# EAGLE design light_module_v1 (EAGLE 6.4)

## Sheet 1 of 2
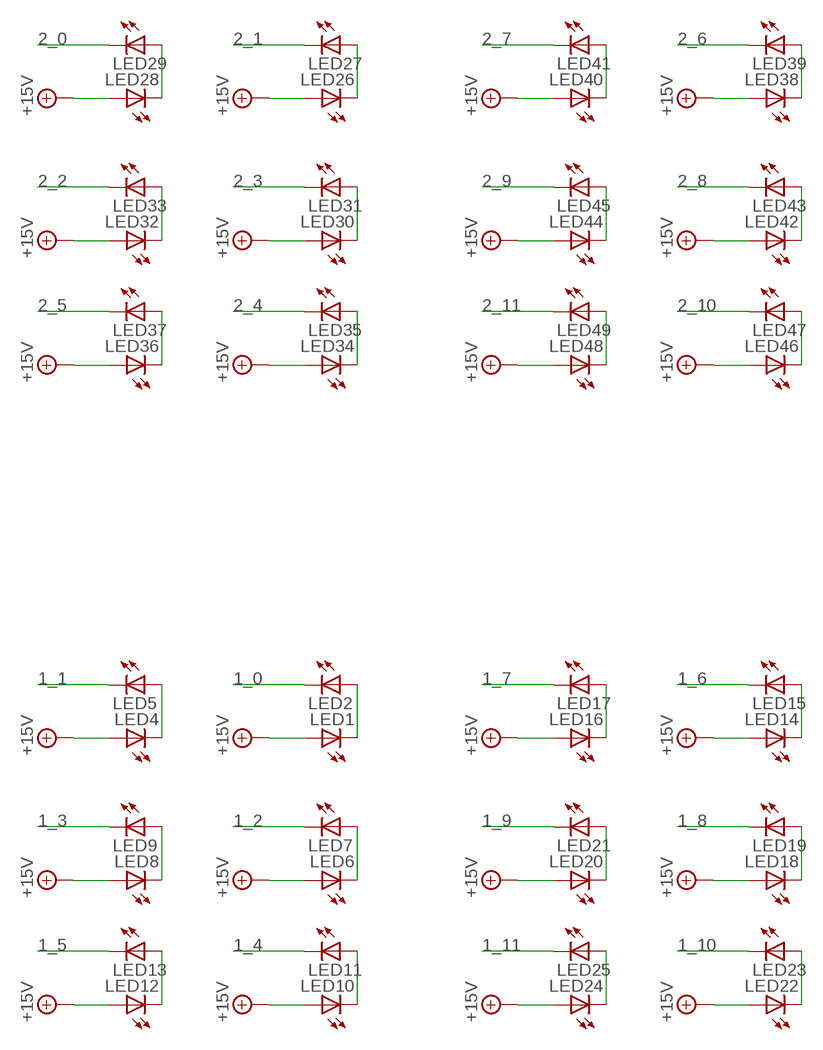
[diagram p0: schematic, sheet 1]

### Parts
LED1  LED  [DS205]
LED2  LED  [DS205]
LED4  LED  [DS205]
LED5  LED  [DS205]
LED6  LED  [DS205]
LED7  LED  [DS205]
LED8  LED  [DS205]
LED9  LED  [DS205]
LED10  LED  [DS205]
LED11  LED  [DS205]
LED12  LED  [DS205]
LED13  LED  [DS205]
LED14  LED  [DS205]
LED15  LED  [DS205]
LED16  LED  [DS205]
LED17  LED  [DS205]
LED18  LED  [DS205]
LED19  LED  [DS205]
LED20  LED  [DS205]
LED21  LED  [DS205]
LED22  LED  [DS205]
LED23  LED  [DS205]
LED24  LED  [DS205]
LED25  LED  [DS205]
LED26  LED  [DS205]
LED27  LED  [DS205]
LED28  LED  [DS205]
LED29  LED  [DS205]
LED30  LED  [DS205]
LED31  LED  [DS205]
LED32  LED  [DS205]
LED33  LED  [DS205]
LED34  LED  [DS205]
LED35  LED  [DS205]
LED36  LED  [DS205]
LED37  LED  [DS205]
LED38  LED  [DS205]
LED39  LED  [DS205]
LED40  LED  [DS205]
LED41  LED  [DS205]
LED42  LED  [DS205]
LED43  LED  [DS205]
LED44  LED  [DS205]
LED45  LED  [DS205]
LED46  LED  [DS205]
LED47  LED  [DS205]
LED48  LED  [DS205]
LED49  LED  [DS205]

### Nets
1_0: LED2.P$2(C) ; also sheet 2
1_1: LED5.P$2(C) ; also sheet 2
1_2: LED7.P$2(C) ; also sheet 2
1_3: LED9.P$2(C) ; also sheet 2
1_4: LED11.P$2(C) ; also sheet 2
1_5: LED13.P$2(C) ; also sheet 2
1_6: LED15.P$2(C) ; also sheet 2
1_7: LED17.P$2(C) ; also sheet 2
1_8: LED19.P$2(C) ; also sheet 2
1_9: LED21.P$2(C) ; also sheet 2
1_10: LED23.P$2(C) ; also sheet 2
1_11: LED25.P$2(C) ; also sheet 2
2_0: LED29.P$2(C) ; also sheet 2
2_1: LED27.P$2(C) ; also sheet 2
2_2: LED33.P$2(C) ; also sheet 2
2_3: LED31.P$2(C) ; also sheet 2
2_4: LED35.P$2(C) ; also sheet 2
2_5: LED37.P$2(C) ; also sheet 2
2_6: LED39.P$2(C) ; also sheet 2
2_7: LED41.P$2(C) ; also sheet 2
2_8: LED43.P$2(C) ; also sheet 2
2_9: LED45.P$2(C) ; also sheet 2
2_10: LED47.P$2(C) ; also sheet 2
2_11: LED49.P$2(C) ; also sheet 2
+15V: LED1.P$1(A) LED4.P$1(A) LED6.P$1(A) LED8.P$1(A) LED10.P$1(A) LED12.P$1(A) LED14.P$1(A) LED16.P$1(A) LED18.P$1(A) LED20.P$1(A) LED22.P$1(A) LED24.P$1(A) LED26.P$1(A) LED28.P$1(A) LED30.P$1(A) LED32.P$1(A) LED34.P$1(A) LED36.P$1(A) LED38.P$1(A) LED40.P$1(A) LED42.P$1(A) LED44.P$1(A) LED46.P$1(A) LED48.P$1(A) ; also sheet 2
N$5: LED1.P$2(C) LED2.P$1(A)
N$9: LED4.P$2(C) LED5.P$1(A)
N$10: LED6.P$2(C) LED7.P$1(A)
N$11: LED8.P$2(C) LED9.P$1(A)
N$12: LED10.P$2(C) LED11.P$1(A)
N$13: LED12.P$2(C) LED13.P$1(A)
N$14: LED14.P$2(C) LED15.P$1(A)
N$15: LED16.P$2(C) LED17.P$1(A)
N$16: LED18.P$2(C) LED19.P$1(A)
N$17: LED20.P$2(C) LED21.P$1(A)
N$18: LED22.P$2(C) LED23.P$1(A)
N$19: LED24.P$2(C) LED25.P$1(A)
N$20: LED26.P$2(C) LED27.P$1(A)
N$21: LED28.P$2(C) LED29.P$1(A)
N$22: LED30.P$2(C) LED31.P$1(A)
N$23: LED32.P$2(C) LED33.P$1(A)
N$24: LED34.P$2(C) LED35.P$1(A)
N$25: LED36.P$2(C) LED37.P$1(A)
N$26: LED38.P$2(C) LED39.P$1(A)
N$27: LED40.P$2(C) LED41.P$1(A)
N$28: LED42.P$2(C) LED43.P$1(A)
N$29: LED44.P$2(C) LED45.P$1(A)
N$30: LED46.P$2(C) LED47.P$1(A)
N$31: LED48.P$2(C) LED49.P$1(A)

## Sheet 2 of 2
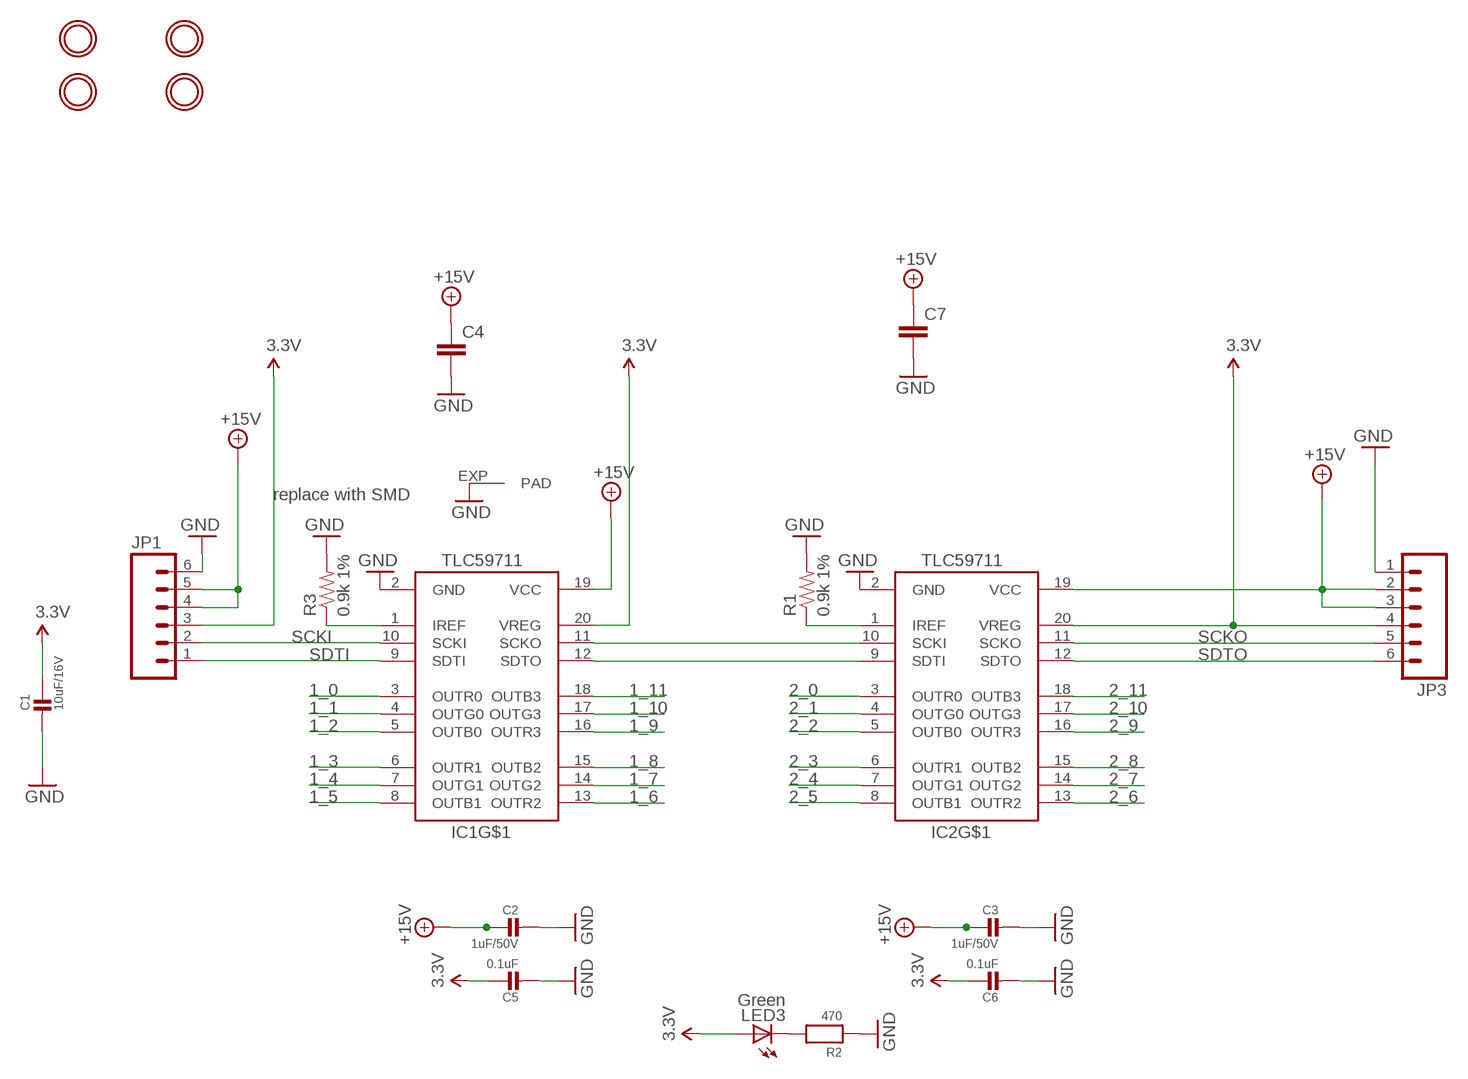
[diagram p1: schematic, sheet 2]

### Parts
C1  10uF/16V  CAP_CERAMIC0805  [0805]
C2  1uF/50V  CAP_CERAMIC0805  [0805]
C3  1uF/50V  CAP_CERAMIC0805  [0805]
C4  CAP1206  [1206]
C5  0.1uF  CAP_CERAMIC0805  [0805]
C6  0.1uF  CAP_CERAMIC0805  [0805]
C7  CAP_  [AXIAL-5MM]
IC1  TLC59711  [HTSSOP20DAP]
IC2  TLC59711  [HTSSOP20DAP]
JP1  M06SMD-STRAIGHT-COMBO-FEMALE  [1X06_SMD_STRAIGHT_COMBO]
JP3  M06SMD-STRAIGHT-COMBO-FEMALE  [1X06_SMD_STRAIGHT_COMBO]
LED3  Green  LEDCHIP-LED0805  [CHIP-LED0805]
R1  0.9k 1%  RESISTOR1206  [1206]
R2  470  RESISTOR0805  [0805]
R3  0.9k 1%  RESISTOR1206  [1206]
U$1  MOUNTINGHOLE2.5  [MOUNTINGHOLE_2.5_PLATED]
U$2  MOUNTINGHOLE2.5  [MOUNTINGHOLE_2.5_PLATED]
U$3  MOUNTINGHOLE2.5  [MOUNTINGHOLE_2.5_PLATED]
U$4  MOUNTINGHOLE2.5  [MOUNTINGHOLE_2.5_PLATED]

### Nets
1_0: IC1.3(OUTR0) ; also sheet 1
1_1: IC1.4(OUTG0) ; also sheet 1
1_2: IC1.5(OUTB0) ; also sheet 1
1_3: IC1.6(OUTR1) ; also sheet 1
1_4: IC1.7(OUTG1) ; also sheet 1
1_5: IC1.8(OUTB1) ; also sheet 1
1_6: IC1.13(OUTR2) ; also sheet 1
1_7: IC1.14(OUTG2) ; also sheet 1
1_8: IC1.15(OUTB2) ; also sheet 1
1_9: IC1.16(OUTR3) ; also sheet 1
1_10: IC1.17(OUTG3) ; also sheet 1
1_11: IC1.18(OUTB3) ; also sheet 1
2_0: IC2.3(OUTR0) ; also sheet 1
2_1: IC2.4(OUTG0) ; also sheet 1
2_2: IC2.5(OUTB0) ; also sheet 1
2_3: IC2.6(OUTR1) ; also sheet 1
2_4: IC2.7(OUTG1) ; also sheet 1
2_5: IC2.8(OUTB1) ; also sheet 1
2_6: IC2.13(OUTR2) ; also sheet 1
2_7: IC2.14(OUTG2) ; also sheet 1
2_8: IC2.15(OUTB2) ; also sheet 1
2_9: IC2.16(OUTR3) ; also sheet 1
2_10: IC2.17(OUTG3) ; also sheet 1
2_11: IC2.18(OUTB3) ; also sheet 1
3.3V: C1.1 C5.1 C6.1 IC1.20(VREG) IC2.20(VREG) JP1.3 JP3.4 LED3.A
+15V: C2.1 C3.1 C4.1 C7.P$1 IC1.19(VCC) IC2.19(VCC) JP1.4 JP1.5 JP3.2 JP3.3 ; also sheet 1
GND: C1.2 C2.2 C3.2 C4.2 C5.2 C6.2 C7.P$2 IC1.2(GND) IC1.EXP(PAD) IC2.2(GND) JP1.6 JP3.1 R1.2 R2.1 R3.2
N$1: LED3.C R2.2
N$2: IC1.1(IREF) R3.1
N$3: IC2.1(IREF) R1.1
N$4: IC1.11(SCKO) IC2.10(SCKI)
N$6: IC1.12(SDTO) IC2.9(SDTI)
SCKI: IC1.10(SCKI) JP1.2
SCKO: IC2.11(SCKO) JP3.5
SDTI: IC1.9(SDTI) JP1.1
SDTO: IC2.12(SDTO) JP3.6
Unconnected: IC2.EXP(PAD)

### Notes on the sheet
- replace with SMD

## Library data of the parts
C1-C3 C5 C6 = microbuilder:CAP_CERAMIC: Ceramic Capacitors For new designs, use the packages preceded by an '_' character since they are more reliable: The following footprints should be used on most boards: _0402 - Standard footprint for regular board layouts _0603 - Standard footprint for regular board layouts _0805 - Standard footprint for regular board layouts For extremely tight-pitch boards where space is at a premium, the following 'micro-pitch' footprints can be used (smaller pads, no silkscreen outline, etc.): _0402MP - Micro-pitch footprint for very dense/compact boards _0603MP - Micro-pitch footprint for very dense/compact boards _0805MP - Micro-pitch footprint for very dense/compact boards Commonly Stocked Parts 0402 - 0402 Surface Mount Capacitors 16pF 50V 5% [Digikey: 445-4899-2-ND] 18pF 50V 5% [Digikey: 490-1281-2-ND] 22pF 50V 5% [Digikey: 490-1283-2-ND] 68pF 50V 5% [Digikey: 490-1289-2-ND] 0.1uF 10V 10% [Digikey: 490-1318-2-ND] 1.0uF 6.3V 10% [Digikey: 490-1320-2-ND] 0603 - 0603 Surface Mount Capacitors 16 pF 50V 5% [Digikey: 445-5051-2-ND] 22 pF 50V [Digikey: PCC220ACVTR-ND] 33 pF 50V 5% [Digikey: 490-1415-1-ND] 56pF 50V 5% [Digikey: 490-1421-1-ND] 220pF 50V 5% [Digikey: 445-1285-1-ND] 680 pF 50V 2200 pF 50V 5% C0G [Digikey: 445-1297-1-ND] 5600 pF 100V 5% X7R [Digikey: 478-3711-1-ND] 0.1 µF 25V 10% [Digikey: PCC2277TR-ND] 0.22 µF 16V 10% X7R [Digikey: 445-1318-1-ND] 1.0 µF 25V 10% [Digikey: 445-5146-2-ND] 0603 - RF Specific 3pF 250V +/-0.1pF RF [Digikey: 712-1347-1-ND] 18 pF 250V 5% [Digikey: 478-3505-1-ND or 712-1322-1-ND] 56 pF 250V 5% C0G RF [Digikey: 490-4867-1-ND] 68 pF 250V RF [Digikey: 490-4868-1-ND] 0805 - 0805 Surface Mount Capacitors 220 pF 250V 2% RF Ceramic Capacitor [Digikey: 712-1398-1-ND] 1000 pF 50V 2% NP0 Ceramic Capacitor [Digikey: 478-3760-1-ND] 0.1 µF 25V 10% Ceramic Capacitor [Digikey: PCC1828TR-ND] 1.0 µF 16V 10% Ceramic Capacitor[Digikey: 490-1691-2-ND] 10.0 µF 10V 10% Ceramic Capacitor[Digikey: 709-1228-1-ND] 10.0 uF 16V 10% Ceramic Capacitor [Digikey: 478-5165-2-ND] 47 uF 6.3V 20% Ceramic Capacitor [Digikey: 587-1779-1-ND or 399-5506-1-ND] 1206 - 1206 Surface Mount Capacitors 47uF 10V 20% Ceramic Capacitor [Digikey: 490-5528-1-ND or 399-5508-1-ND or 445-6010-1-ND] 100uF 6.3V -20%, +80% Y5V Ceramic Capacitor (Digikey: 490-4512-1-ND, Mouser: 81-GRM31CF50J107ZE1L)
C4 C7 = SparkFun-Passives:CAP: Capacitor Standard 0603 ceramic capacitor, and 0.1" leaded capacitor.
IC1 IC2 = adafruit:TLC59711
JP1 JP3 = SparkFun-Connectors:M06: Header 6 Standard 6-pin 0.1" header. Use with straight break away headers (SKU : PRT-00116), right angle break away headers (PRT-00553), swiss pins (PRT-00743), machine pins (PRT-00117), and female headers (PRT-00115). Molex polarized connector foot print use with SKU : PRT-08094 with associated crimp pins and housings. NOTES ON THE VARIANTS LOCK and LOCK_LONGPADS... This footprint was designed to help hold the alignment of a through-hole component (i.e. 6-pin header) while soldering it into place. You may notice that each hole has been shifted either up or down by 0.005 of an inch from it's more standard position (which is a perfectly straight line). This slight alteration caused the pins (the squares in the middle) to touch the edges of the holes. Because they are alternating, it causes a "brace" to hold the component in place. 0.005 has proven to be the perfect amount of "off-center" position when using our standard breakaway headers. Although looks a little odd when you look at the bare footprint, once you have a header in there, the alteration is very hard to notice. Also,if you push a header all the way into place, it is covered up entirely on the bottom side. This idea of altering the position of holes to aid alignment will be further integrated into the Sparkfun Library for other footprints. It can help hold any component with 3 or more connection pins.; PROD_ID: CONN-10203
LED1 LED2 LED4-LED49 = digikey:LED
LED3 = adafruit:LED: LED OSRAM: - CHIPLED LG R971, LG N971, LY N971, LG Q971, LY Q971, LO R971, LY R971 LH N974, LH R974 LS Q976, LO Q976, LY Q976 LO Q996 - Hyper CHIPLED LW Q18S LB Q993, LB Q99A, LB R99A - SideLED LS A670, LO A670, LY A670, LG A670, LP A670 LB A673, LV A673, LT A673, LW A673 LH A674 LY A675 LS A676, LA A676, LO A676, LY A676, LW A676 LS A679, LY A679, LG A679 - Hyper Micro SIDELED® LS Y876, LA Y876, LO Y876, LY Y876 LT Y87S - SmartLED LW L88C, LW L88S LB L89C, LB L89S, LG L890 LS L89K, LO L89K, LY L89K LS L896, LA L896, LO L896, LY L896 - TOPLED LS T670, LO T670, LY T670, LG T670, LP T670 LSG T670, LSP T670, LSY T670, LOP T670, LYG T670 LG T671, LOG T671, LSG T671 LB T673, LV T673, LT T673, LW T673 LH T674 LS T676, LA T676, LO T676, LY T676, LB T676, LH T676, LSB T676, LW T676 LB T67C, LV T67C, LT T67C, LS T67K, LO T67K, LY T67K, LW E67C LS E67B, LA E67B, LO E67B, LY E67B, LB E67C, LV E67C, LT E67C LW T67C LS T679, LY T679, LG T679 LS T770, LO T770, LY T770, LG T770, LP T770 LB T773, LV T773, LT T773, LW T773 LH T774 LS E675, LA E675, LY E675, LS T675 LS T776, LA T776, LO T776, LY T776, LB T776 LHGB T686 LT T68C, LB T68C - Hyper Mini TOPLED® LB M676 - Mini TOPLED Santana® LG M470 LS M47K, LO M47K, LY M47K Source: http://www.osram.convergy.de/
R1 R3 = SparkFun-Passives:RESISTOR: Resistor Basic schematic elements and footprints for 0603, 1206, and PTH resistors.
R2 = microbuilder:RESISTOR: Resistors For new designs, use the packages preceded by an '_' character since they are more reliable: The following footprints should be used on most boards: _0402 - Standard footprint for regular board layouts _0603 - Standard footprint for regular board layouts _0805 - Standard footprint for regular board layouts For extremely tight-pitch boards where space is at a premium, the following 'micro-pitch' footprints can be used (smaller pads, no silkscreen outline, etc.): _0402MP - Micro-pitch footprint for very dense/compact boards _0603MP - Micro-pitch footprint for very dense/compact boards _0805MP - Micro-pitch footprint for very dense/compact boards
U$1-U$4 = microbuilder:MOUNTINGHOLE: Mounting Hole For #2 screws (0.086"/2.18mm width, 0.094"/2.4mm hole) use 2.5mm

## Board
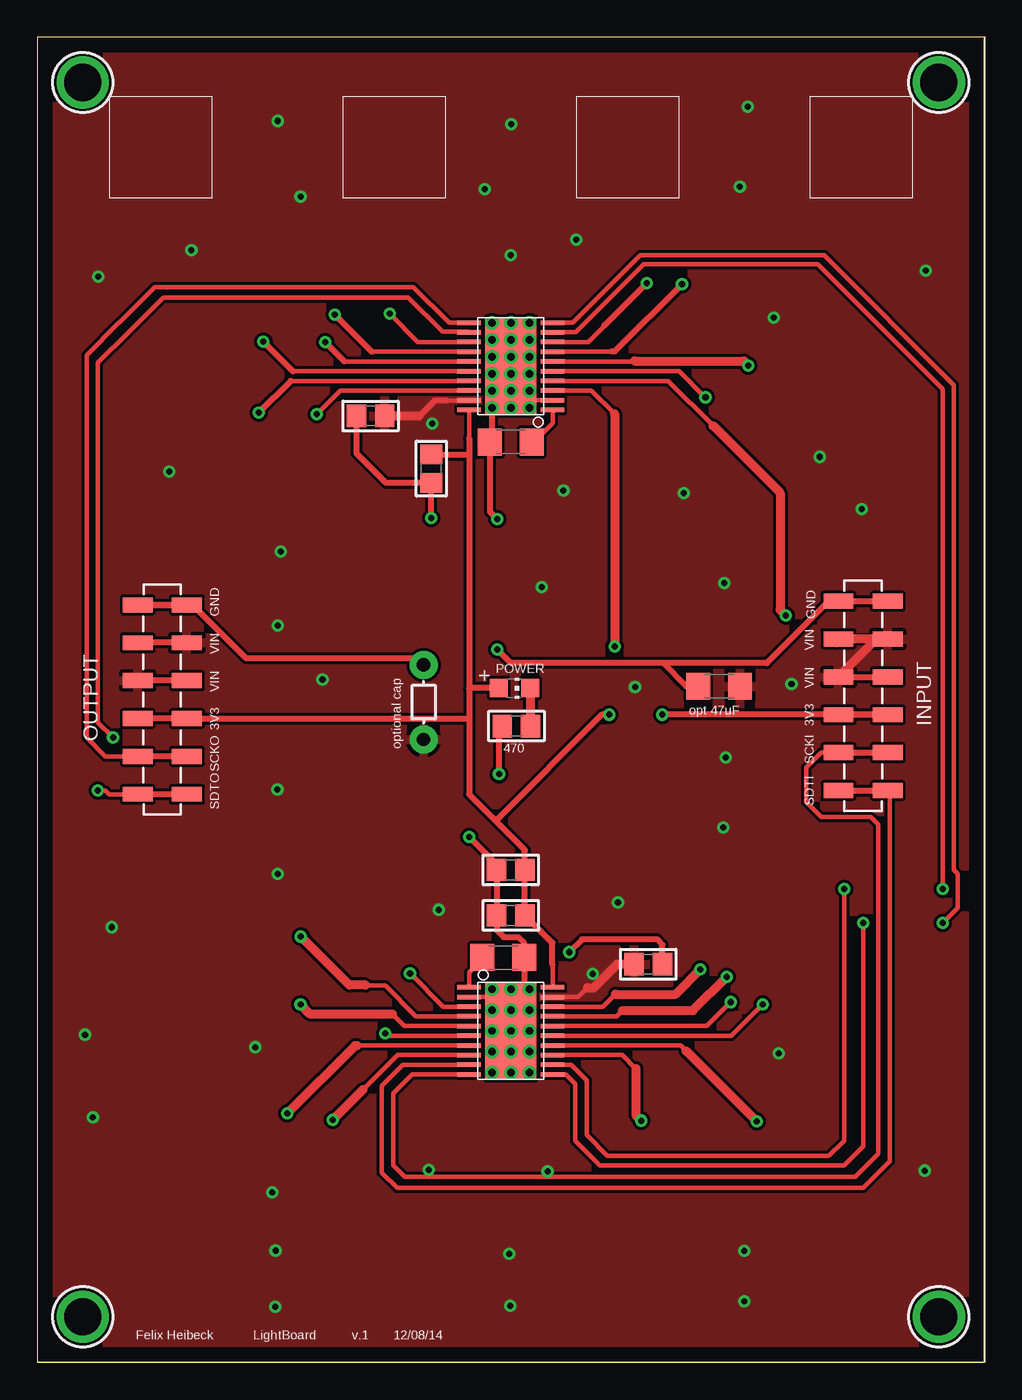
[diagram p2: board, top side]
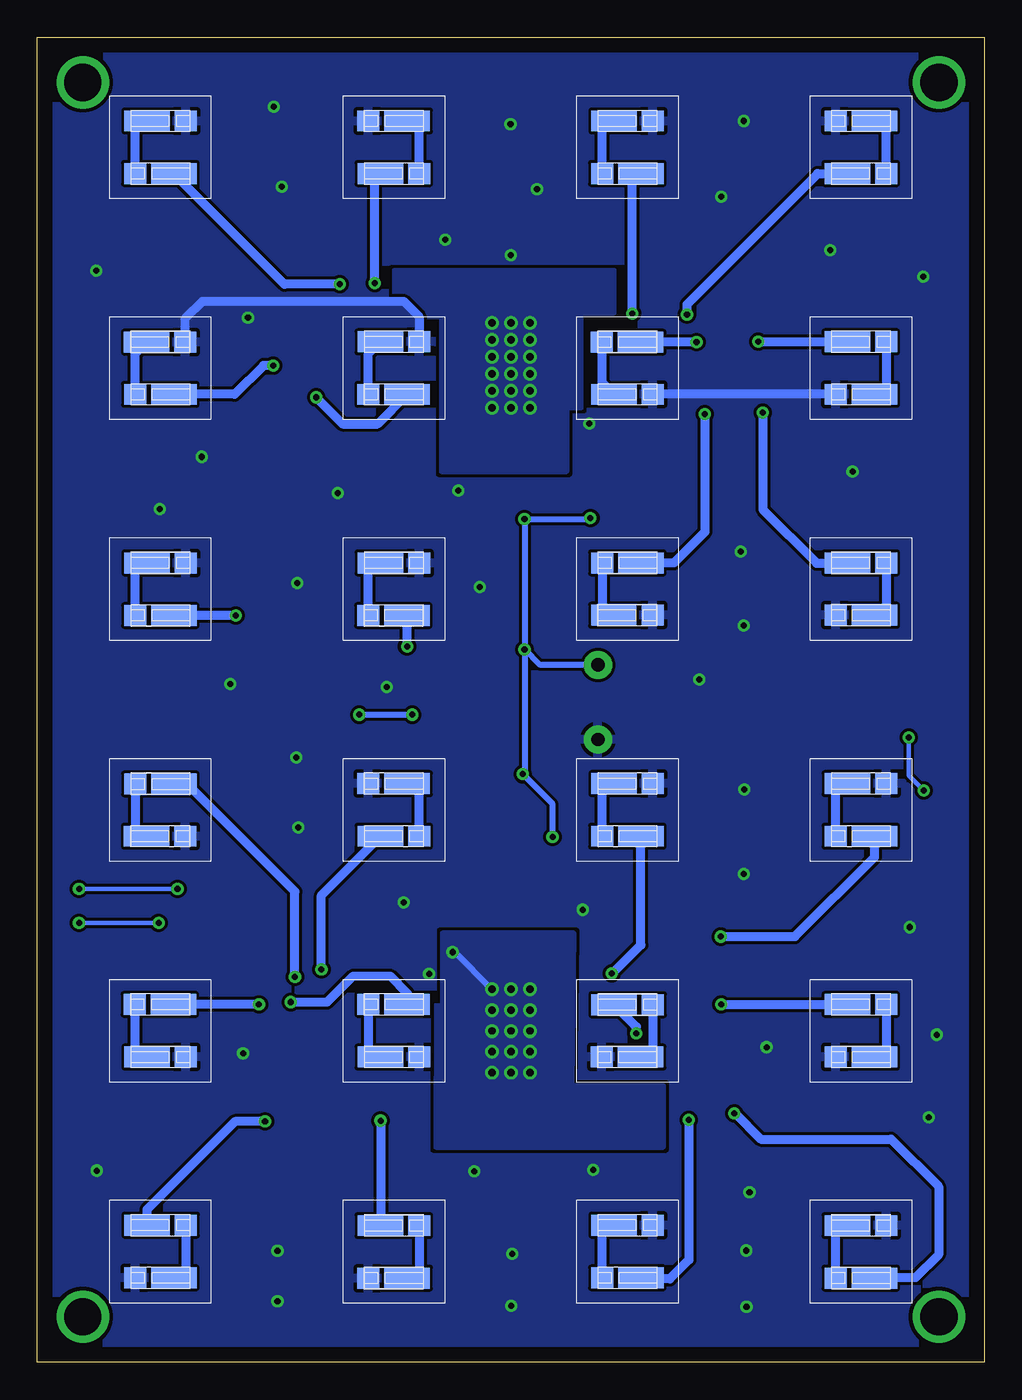
[diagram p3: board, bottom side, seen from below]

Size 63.51 x 88.87 mm. Coordinates in mm from the lower left corner, seen from the top.
Outline: 0,0 63.51,0 63.51,88.88 0,88.88 0,0
Copper layers (1*16): Top 0.035mm / dielectric 1.5mm / Bottom 0.035mm
Design rules "default *": minimum track width 10mil, minimum drill 24mil, track to track 8mil, track to pad 8mil, pad to pad 8mil, via to via 8mil, smd to smd 8mil, copper to edge 40mil, drill to drill 8mil, minimum pad ring 10mil, minimum via ring 8mil, stop-mask expansion 4mil, vias tented up to drill 16mil, thermal gap 10mil

### Footprints (pad centres in the part's own frame; a part is rotated, then mirrored left to right if it is on the bottom)
0805 = smd 1.3 x 1.5: 1 -0.95,0; 2 0.95,0
1206 = smd 1.6 x 1.8: 1 -1.4,0; 2 1.4,0
AXIAL-5MM = drill 0.9 pad 1.88: P$1 -2.5,0; P$2 2.5,0
HTSSOP20DAP = smd 0.3 x 1.55: 1 -2.925,-2.8; 2 -2.275,-2.8; 3 -1.625,-2.8; 4 -0.975,-2.8; 5 -0.325,-2.8; 6 0.325,-2.8; 7 0.975,-2.8; 8 1.625,-2.8; 9 2.275,-2.8; 10 2.925,-2.8; 11 2.925,2.8; 12 2.275,2.8; 13 1.625,2.8; 14 0.975,2.8; 15 0.325,2.8; 16 -0.325,2.8; 17 -0.975,2.8; 18 -1.625,2.8; 19 -2.275,2.8; 20 -2.925,2.8 | smd 6.5 x 3.4: EXP 0,0
1X06_SMD_STRAIGHT_COMBO = smd 1 x 2: 1 0,-1.65; 1-2 0,1.65; 2 2.54,1.65; 2-2 2.54,-1.65; 3 5.08,-1.65; 3-2 5.08,1.65; 4 7.62,1.65; 4-2 7.62,-1.65; 5 10.16,-1.65; 5-2 10.16,1.65; 6 12.7,1.65; 6-2 12.7,-1.65
DS205 = smd 1.473 x 1.4: P$1 -1.65,0 | smd 3.048 x 1.4: P$2 0.95,0
CHIP-LED0805 = smd 1.2 x 1.2: A 0,-1.05; C 0,1.05
MOUNTINGHOLE_2.5_PLATED = drill 2.5 pad 3.2: P$1 0,0

### Placement (x,y rotation side)
C1  31.75,29.97 180 top
C2  40.97,26.7 0 top
C3  22.35,63.47 180 top
C4  45.72,45.34 180 top
C5  31.75,33.02 180 top
C6  26.42,59.94 270 top
C7  25.91,44.27 90 top
IC1  31.75,22.23 270 top
IC2  31.75,66.8 90 top
JP1  55.37,38.35 90 top
JP3  8.38,50.8 270 top
LED1  23.88,38.81 180 bottom
LED2  23.98,35.28 0 bottom
LED3  32,45.21 270 top
LED4  8.23,38.81 180 bottom
LED5  8.33,35.28 0 bottom
LED6  8.33,20.47 0 bottom
LED7  8.23,24 180 bottom
LED8  24,20.47 0 bottom
LED9  23.88,23.98 180 bottom
LED10  8.23,9.17 180 bottom
LED11  8.33,5.64 0 bottom
LED12  23.88,9.19 180 bottom
LED13  23.98,5.66 0 bottom
LED14  39.65,5.64 0 bottom
LED15  39.55,9.17 180 bottom
LED16  55.3,5.66 0 bottom
LED17  55.19,9.19 180 bottom
LED18  55.19,20.47 180 bottom
LED19  55.32,24 0 bottom
LED20  39.55,20.47 180 bottom
LED21  39.65,24 0 bottom
LED22  55.22,35.28 180 bottom
LED23  55.3,38.79 0 bottom
LED24  39.65,38.81 0 bottom
LED25  39.55,35.28 180 bottom
LED26  55.19,53.62 180 bottom
LED27  55.3,50.09 0 bottom
LED28  39.55,53.62 180 bottom
LED29  39.67,50.09 0 bottom
LED30  55.22,68.43 180 bottom
LED31  55.3,64.92 0 bottom
LED32  39.55,68.45 180 bottom
LED33  39.65,64.92 0 bottom
LED34  55.19,83.26 180 bottom
LED35  55.3,79.73 0 bottom
LED36  39.65,83.26 0 bottom
LED37  39.55,79.73 180 bottom
LED38  23.88,83.26 180 bottom
LED39  23.98,79.73 0 bottom
LED40  8.33,83.26 0 bottom
LED41  8.23,79.73 180 bottom
LED42  23.88,64.92 180 bottom
LED43  24,68.43 0 bottom
LED44  8.33,64.92 0 bottom
LED45  8.23,68.45 180 bottom
LED46  8.33,50.11 0 bottom
LED47  8.23,53.62 180 bottom
LED48  23.9,50.11 180 bottom
LED49  23.98,53.62 0 bottom
R1  31.75,61.72 180 top
R2  32.13,42.67 0 top
R3  31.24,27.15 0 top
U$1  3.05,3.05 0 top
U$2  60.45,3.05 0 top
U$3  3.05,85.85 0 top
U$4  60.45,85.85 0 top

### Tracks (layer width: path | path; a pad name or v marks a point on that pad's centre or on a via)
1_0  (via drill 0.41)
  Top 0.305: IC1.3 27.23,23.85 v24.99,26.09
  Bottom 0.61: v24.99,26.09 24.94,26.09 23.04,27.99 LED2.P$2
1_1  (via drill 0.41)
  Top 0.305: IC1.4 25.39,23.2 23.32,25.27 22.05,25.27 22.02,25.3
  Top 0.61: 22.02,25.3 20.93,25.3 v17.68,28.55
  Bottom 0.61: v17.68,28.55 12.7,28.55 7.37,33.88 7.37,35.27 LED5.P$2
1_2  (via drill 0.41)
  Top 0.305: IC1.5 24.62,22.55 23.82,23.34
  Top 0.61: 23.82,23.34 18.31,23.34 v17.65,24
  Bottom 0.61: v17.65,24 LED7.P$2
1_3  (via drill 0.41)
  Top 0.305: IC1.6 23.49,21.9 v23.34,22.05
  Bottom 0.61: v23.34,22.05 23.34,22.49 LED9.P$2
1_4  (via drill 0.41)
  Top 0.305: IC1.7 21.45,21.25 21.44,21.23
  Top 0.61: 21.44,21.23 21.31,21.23 v16.76,16.69
  Bottom 0.61: v16.76,16.69 16.71,16.69 14.99,14.96 6.25,14.96 3.07,11.79 3.07,7.21 4.62,5.66 7.36,5.66 LED11.P$2
1_5  (via drill 0.41)
  Top 0.305: IC1.8 24.16,20.6 21.84,18.29
  Top 0.61: 21.84,18.29 v19.81,16.26
  Bottom 0.61: v19.81,16.26 19.81,6.86 21.08,5.59 22.95,5.59 LED13.P$2
1_6  (via drill 0.41)
  Top 0.305: IC1.13 39.22,20.6 40.13,19.68
  Top 0.61: 40.13,19.68 40.13,16.56 v40.49,16.2
  Bottom 0.406: 40.49,9.18 LED15.P$2
  Bottom 0.61: v40.49,16.2 40.49,9.18
1_7  (via drill 0.41)
  Top 0.305: IC1.14 43.14,21.25 43.51,20.88
  Top 0.61: 43.51,20.88 v48.23,16.15
  Bottom 0.406: 56.16,9.21 LED17.P$2
  Bottom 0.61: v48.23,16.15 50.24,16.15 56.16,10.24 56.16,9.21
1_8  (via drill 0.41)
  Top 0.305: IC1.15 46.54,21.9 v48.64,24
  Bottom 0.61: v48.64,24 LED19.P$2
1_9  (via drill 0.41)
  Top 0.305: IC1.16 44.9,22.55 v46.51,24.16
  Bottom 0.61: v46.51,24.16 44.07,24.16 42.32,25.91 39.85,25.91 38.68,24.74 38.68,24.02 LED21.P$2
1_10  (via drill 0.41)
  Top 0.305: IC1.17 38.85,23.2 39.24,23.6
  Top 0.61: 39.24,23.6 43.97,23.6 v46.23,25.86
  Bottom 0.61: v46.23,25.86 46.23,31.57 53.44,38.79 LED23.P$2
1_11  (via drill 0.41)
  Top 0.305: IC1.18 37.92,23.85 38.76,24.69
  Top 0.61: 38.76,24.69 42.8,24.69 v44.45,26.34
  Bottom 0.61: v44.45,26.34 44.45,31.33 LED25.P$2
2_0  (via drill 0.41)
  Top 0.305: IC2.3 37.16,65.18 38.71,63.63
  Top 0.61: 38.71,63.63 v38.71,48.01
  Bottom 0.61: v38.71,48.01 38.71,50.07 LED29.P$2
2_1  (via drill 0.41)
  Top 0.305: IC2.4 42.3,65.83 45.31,62.81
  Top 0.61: 45.31,62.81 49.81,58.32 49.81,50.47 v50.19,50.09
  Bottom 0.61: v50.19,50.09 LED27.P$2
2_2  (via drill 0.41)
  Top 0.305: IC2.5 43.05,66.48 v44.81,64.72
  Bottom 0.61: v44.81,64.72 43.03,62.94 40.68,62.94 LED33.P$2
2_3  (via drill 0.41)
  Top 0.305: IC2.6 40,67.13 40.03,67.16
  Top 0.61: 40.03,67.16 47.37,67.16 v47.68,66.85
  Bottom 0.61: v47.68,66.85 48.34,66.85 50.27,64.92 LED31.P$2
2_4  (via drill 0.41)
  Top 0.305: IC2.7 38.47,67.78 38.51,67.82
  Top 0.406: 38.51,67.82 38.73,67.82 v43.23,72.31
  Bottom 0.61: v43.23,72.31 46.93,72.31 LED35.P$2
2_5  (via drill 0.41)
  Top 0.305: IC2.8 36.93,68.43 38.05,69.55
  Top 0.406: 38.05,69.55 38.05,69.57 v40.87,72.39
  Bottom 0.61: v40.87,72.39 40.87,79.36 LED37.P$2
2_6  (via drill 0.41)
  Top 0.305: IC2.13 25.53,68.43 v23.62,70.33
  Bottom 0.61: v23.62,70.33 23.62,79.14 LED39.P$2
2_7  (via drill 0.41)
  Top 0.305: IC2.14 22.44,67.78
  Top 0.406: 22.44,67.78 v19.94,70.28
  Bottom 0.61: v19.94,70.28 19.94,70.97 11.18,79.73 LED41.P$2
2_8  (via drill 0.41)
  Top 0.305: IC2.15 20.61,67.13
  Top 0.406: 20.61,67.13 v19.3,68.43
  Bottom 0.61: v19.3,68.43 LED43.P$2
2_9  (via drill 0.41)
  Top 0.305: IC2.16 17.14,66.48
  Top 0.406: 17.14,66.48 v15.16,68.45
  Bottom 0.61: v15.16,68.45 LED45.P$2
2_10  (via drill 0.41)
  Top 0.305: IC2.17 16.98,65.83
  Top 0.406: 16.98,65.83 v14.86,63.7
  Bottom 0.61: v14.86,63.7 14.86,57.2 11.25,53.59 9.21,53.59 LED47.P$2
2_11  (via drill 0.41)
  Top 0.305: IC2.18 20.32,65.18 v18.75,63.6
  Bottom 0.61: v18.75,63.6 18.75,55.7 20.83,53.62 LED49.P$2
3.3V  (via drill 0.41)
  Top 0.305: 28.95,61.98 28.96,61.98 IC2.20 | IC1.20 34.55,26.66 34.54,26.67
  Top 0.406: 34.54,26.67 34.54,28.13 C1.1 C5.1 32.7,34.36 30.73,36.32 | 30.73,36.32 28.96,38.1 28.96,43.18 | 28.96,61.98 28.96,60.96 | 28.96,60.96 28.96,45.21 | 28.96,45.21 28.96,43.18 | C6.1 28.89,60.89 28.96,60.96 | LED3.A 28.96,45.21 | JP3.4 28.96,43.18 | JP1.3 v41.91,43.43 | v38.35,43.43 37.85,43.43 30.73,36.32
  Bottom 0.406: v41.91,43.43 v38.35,43.43
+15V  (via drill 0.41)
  Top 0.305: 27.43,64.52 28.94,64.52 IC2.19 | IC1.19 36.26,24.5 36.88,25.12
  Top 0.406: 27.43,64.52 26.64,64.52 25.6,63.48
  Top 0.61: JP1.4 56.26,48.51 JP1.5 53.85,48.51 53.59,48.26 | 25.6,63.48 C3.1 | C2.1 38.89,26.7 37.31,25.12 36.88,25.12
  Bottom 0.61: LED44.P$1 LED42.P$1 | LED30.P$1 53.57,70.03 52.43,71.17 38.94,71.17 37.9,70.13 LED32.P$1
  other vias: 47.4,7.47 37.24,26.06 34.21,12.8 31.65,7.26 15.98,7.49 14.61,21.13 49.71,20.73 16.1,38.43 46,35.86 16.33,54.38 16.13,49.43 55.3,57.23 46.08,52.27 33.83,51.99 17.65,78.18 16.13,83.26 31.78,83.03 30,78.69 47.65,84.23 47.12,78.84 49.38,70.08 4.09,72.82 59.56,73.23 31.75,74.27 3.2,21.97 15.75,11.4 26.24,12.9 59.51,12.85 47.4,4.09 31.72,3.78 15.95,3.71 16.13,32.77 26.92,30.35 38.94,30.84 46.15,40.56 50.57,45.49 43.36,58.29 35.28,58.47 8.84,59.74 19.13,45.8 36.14,75.31 10.34,74.6 5,29.18 3.73,16.43 40.08,45.29 26.49,62.97 52.48,60.73
  pour Top: -2.03,90.93 64.26,90.68 64.26,-3.3 -3.81,-3.05 -3.81,90.93
  pour Bottom (rank 2): -1.27,90.42 65.02,90.17 65.02,-3.81 -3.05,-3.56 -3.05,90.42
GND  (via drill 0.41, 0.5)
  Top 0.305: IC2.2 32.27,64.53 v31.75,64.01 | IC1.2 31.23,24.5 v31.75,25.02
  Top 0.406: v30.48,64.01 30.48,62.09 R1.2 30.35,57.05 v30.84,56.57 v30.85,56.58 | C3.2 21.4,60.97 23.37,59 26.41,59 C6.2 v26.42,56.62 | 32.65,24.52 R3.2 32.64,27.19 32.64,28.12 32.23,28.52 31.27,28.52 30.8,28.99 C1.2 C5.2 30.8,33.39 v28.96,35.23 | 32.65,24.52 v31.75,23.62 | C2.2 41.92,28.01 41.55,28.37 36.52,28.37 v35.66,27.51 | v30.96,39.45 30.96,42.45 R2.1 | JP1.6 53.09,51.05 48.92,46.89 41.96,46.89 | 41.96,46.89 31.75,46.89 v30.84,47.8 | C4.2 43.51,45.34 41.96,46.89 | 32.65,24.52 32.65,23.99 v33.02,23.62 | v33.02,20.83 v33.02,22.23 IC1.EXP v30.48,22.23 | v33.02,20.83 v31.75,20.83 v30.48,20.83 | v33.02,20.83 33.02,20.7 v31.75,19.43 | v33.02,19.43 v33.02,20.83 | JP3.1 10.41,50.8 13.97,47.24 25.44,47.24 C7.P$2
  Bottom 0.406: v26.42,56.62 26.47,56.57 v30.84,56.57 v30.84,47.8 | v35.66,27.51 35.51,27.51 v33.02,25.02 | v28.96,35.23 28.96,37.44 v30.96,39.45 30.84,39.57 v30.84,47.8 | C7.P$2 29.8,46.77 v30.84,47.8 | v30.48,25.02 30.48,24.89 | 31.62,24.89 v31.75,25.02
  other vias: 30.48,23.62 31.75,22.23 33.02,64.01 31.75,65.15 31.75,66.29 31.75,67.44 31.75,68.58 31.75,69.72 33.02,65.15 33.02,66.29 33.02,67.44 30.48,65.15 30.48,66.29 30.48,67.44 33.02,68.58 33.02,69.72 30.48,68.58 30.48,69.72 30.48,19.43
  pour Bottom: 27.53,28.75 36.32,28.75 36.32,23.88 36.68,23.88 36.68,23.93 36.73,23.93 36.75,14.45 21.54,14.45 21.54,18.52 27.66,18.52 27.66,18.57
  pour Bottom: 24.84,73.2 39.55,73.2 39.55,70.18 36.4,70.18 36.4,59.79 28.02,59.79 28.02,64.06 27.05,64.06 27.05,70.41 24.84,70.41
N$1
  Top 0.61: LED3.C 33.05,42.7 R2.2
N$2
  Top 0.305: R3.1 29.97,27.18 28.96,26.16 IC1.1
N$3
  Top 0.305: IC2.1 34.55,63 33.27,61.72 R1.1
N$4  (via drill 0.41)
  Top 0.305: v60.71,29.46 61.72,30.48 61.72,32.77 61.47,33.02 61.47,65.53 52.76,74.24 40.44,74.24 35.92,69.72 IC2.10 | v55.37,29.46 55.37,14.48 54.1,13.21 37.72,13.21 36.07,14.86 36.07,18.67 35.43,19.3 IC1.11
  Bottom 0.305: v60.71,29.46 v55.37,29.46
N$5
  Bottom 0.61: LED2.P$1 25.63,38.74 25.55,38.81 LED1.P$2
N$6  (via drill 0.41)
  Top 0.305: v54.1,31.75 54.1,14.86 53.09,13.84 38.23,13.84 36.83,15.24 36.83,18.92 35.8,19.95 IC1.12 | v60.71,31.75 60.71,65.28 57.05,68.94 56.9,69.09 52.32,73.66 40.66,73.66 36.09,69.09 IC2.9
  Bottom 0.305: v54.1,31.75 v60.71,31.75
N$9
  Bottom 0.61: LED5.P$1 9.98,38.56 9.73,38.81 LED4.P$2
N$10
  Bottom 0.61: LED7.P$1 6.58,20.65 6.78,20.45 7.36,20.45 LED6.P$2
N$11
  Bottom 0.61: LED9.P$1 22.23,20.47 22.28,20.42 23,20.42 LED8.P$2
N$12
  Bottom 0.61: LED11.P$1 9.98,9.02 9.88,9.12 9.23,9.12 LED10.P$2
N$13
  Bottom 0.61: LED13.P$1 25.63,9.04 25.48,9.2 LED12.P$2
N$14
  Bottom 0.61: LED15.P$1 37.9,5.84 38.1,5.64 LED14.P$2
N$15
  Bottom 0.61: LED17.P$1 53.54,5.84 53.7,5.69 54.32,5.69 LED16.P$2
N$16
  Bottom 0.61: LED19.P$1 56.97,20.47 LED18.P$2
N$17
  Bottom 0.61: LED21.P$1 41.3,20.52 41.4,20.42 40.55,20.42 LED20.P$2
N$18
  Bottom 0.61: LED23.P$1 56.95,35.36 57,35.31 56.2,35.31 LED22.P$2
N$19
  Bottom 0.61: LED25.P$1 37.9,38.71 38.02,38.84 38.67,38.84 LED24.P$2
N$20
  Bottom 0.61: LED27.P$1 56.95,53.54 56.84,53.65 56.17,53.65 LED26.P$2
N$21
  Bottom 0.61: LED29.P$1 41.33,53.52 41.25,53.59 40.52,53.59 LED28.P$2
N$22
  Bottom 0.61: LED31.P$1 56.95,67.65 LED30.P$2
N$23
  Bottom 0.61: LED33.P$1 41.3,67.65 LED32.P$2
N$24
  Bottom 0.61: LED35.P$1 56.95,83.18 57,83.24 56.17,83.24 LED34.P$2
N$25
  Bottom 0.61: LED37.P$1 37.9,83.11 38.05,83.26 LED36.P$2
N$26
  Bottom 0.61: LED39.P$1 25.63,83.26 25.65,83.29 24.85,83.29 LED38.P$2
N$27
  Bottom 0.61: LED41.P$1 6.58,83.21 6.63,83.26 LED40.P$2
N$28
  Bottom 0.61: LED43.P$1 25.65,65.75 LED42.P$2
N$29
  Bottom 0.61: LED45.P$1 6.58,65.02 6.76,64.85 7.3,64.85 LED44.P$2
N$30
  Bottom 0.61: LED47.P$1 6.58,50.19 6.68,50.09 7.36,50.09 LED46.P$2
N$31
  Bottom 0.61: LED49.P$1 25.63,50.22 25.73,50.11 LED48.P$2
SCKI
  Top 0.305: IC1.10 25.15,19.3 23.88,18.03 23.88,13.21 24.64,12.45 54.86,12.45 56.39,13.97 56.39,36.07 55.88,36.58 52.58,36.58 51.56,37.59 51.56,39.88 52.58,40.89 JP1.2
SCKO
  Top 0.305: JP3.5 4.57,40.64 3.3,41.91 3.3,67.56 5.46,69.73 5.49,69.73 7.87,72.11 25.22,72.11 27.61,69.72 IC2.11
SDTI
  Top 0.305: IC1.9 24.52,19.95 23.11,18.54 23.11,12.7 24.13,11.68 55.37,11.68 57.15,13.46 57.15,38.23 JP1.1
SDTO  (via drill 0.41)
  Top 0.305: v5.08,41.91 4.06,42.93 4.06,67.06 6.08,69.08 6.11,69.08 8.46,71.42 24.87,71.42 27.18,69.11 28.91,69.11 IC2.12 | v4.06,38.35 4.57,38.35 4.83,38.1 JP3.6
  Bottom 0.305: v5.08,41.91 5.08,39.37 v4.06,38.35

### Text on the board
tPlace: POWER | opt 47uF | INPUT | OUTPUT | optional cap | 470 | Felix Heibeck | LightBoard | v.1 | 12/08/14
tNames: GND | GND | VIN | VIN | VIN | VIN | 3V3 | 3V3 | SCKO | SCKI | SDTO | SDTI
tValues: 1uF/50V